# Altium schematic sheet 202014A2232.SchDoc
size A4
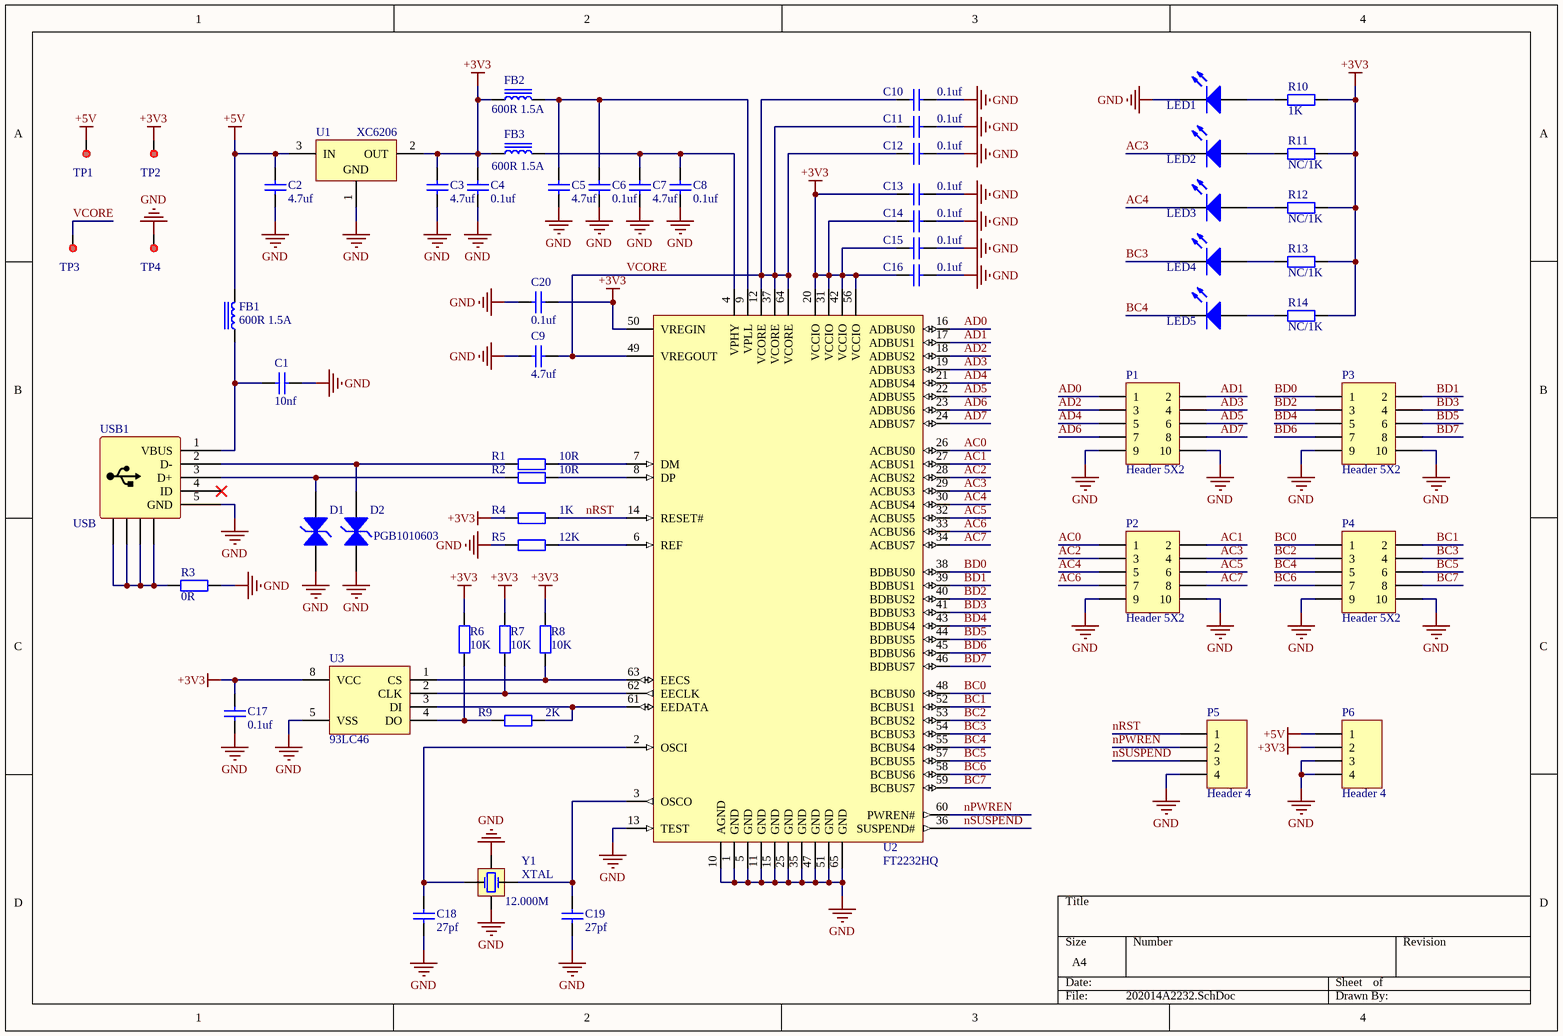
[diagram p0: 202014A2232.SchDoc]

## Parts
C1  value 10nf  [C0805]  (hidden comment: Cap)
C2  value 4.7uf  [C0805]  (hidden comment: Cap)
C3  value 4.7uf  [C0805]  (hidden comment: Cap)
C4  value 0.1uf  [C0805]  (hidden comment: Cap)
C5  value 4.7uf  [C0805]  (hidden comment: Cap)
C6  value 0.1uf  [C0805]  (hidden comment: Cap)
C7  value 4.7uf  [C0805]  (hidden comment: Cap)
C8  value 0.1uf  [C0805]  (hidden comment: Cap)
C9  value 4.7uf  [C0805]  (hidden comment: Cap)
C10  value 0.1uf  [C0805]  (hidden comment: Cap)
C11  value 0.1uf  [C0805]  (hidden comment: Cap)
C12  value 0.1uf  [C0805]  (hidden comment: Cap)
C13  value 0.1uf  [C0805]  (hidden comment: Cap)
C14  value 0.1uf  [C0805]  (hidden comment: Cap)
C15  value 0.1uf  [C0805]  (hidden comment: Cap)
C16  value 0.1uf  [C0805]  (hidden comment: Cap)
C17  value 0.1uf  [C0805]  (hidden comment: Cap)
C18  value 27pf  [C0805]  (hidden comment: Cap)
C19  value 27pf  [C0805]  (hidden comment: Cap)
C20  value 0.1uf  [C0805]  (hidden comment: Cap)
D1  PGB1010603  [PGB1010603-0603]  (value not drawn)
D2  PGB1010603  [PGB1010603-0603]
FB1  value 600R 1.5A  [FB0805]  (hidden comment: Ferrite Bead)
FB2  value 600R 1.5A  [FB0805]  (hidden comment: Ferrite Bead)
FB3  value 600R 1.5A  [FB0805]  (hidden comment: Ferrite Bead)
LED1  LED  [LED1206]  (value not drawn)
LED2  LED  [LED1206]  (value not drawn)
LED3  LED  [LED1206]  (value not drawn)
LED4  LED  [LED1206]  (value not drawn)
LED5  LED  [LED1206]  (value not drawn)
P1  Header 5X2  [HDR2X5]
P2  Header 5X2  [HDR2X5]
P3  Header 5X2  [HDR2X5]
P4  Header 5X2  [HDR2X5]
P5  Header 4  [HDR1X4]
P6  Header 4  [HDR1X4]
R1  value 10R  [R0805]  (hidden comment: Res)
R2  value 10R  [R0805]  (hidden comment: Res)
R3  value 0R  [R0805]  (hidden comment: Res)
R4  value 1K  [R0805]  (hidden comment: Res)
R5  value 12K  [R0805]  (hidden comment: Res)
R6  value 10K  [R0805]  (hidden comment: Res)
R7  value 10K  [R0805]  (hidden comment: Res)
R8  value 10K  [R0805]  (hidden comment: Res)
R9  value 2K  [R0805]  (hidden comment: Res)
R10  value 1K  [R0805]  (hidden comment: Res)
R11  value NC/1K  [R0805]  (hidden comment: Res)
R12  value NC/1K  [R0805]  (hidden comment: Res)
R13  value NC/1K  [R0805]  (hidden comment: Res)
R14  value NC/1K  [R0805]  (hidden comment: Res)
TP1  TestPoint  [TestPoint-R30]  (value not drawn)
TP2  TestPoint  [TestPoint-R30]  (value not drawn)
TP3  TestPoint  [TestPoint-R30]  (value not drawn)
TP4  TestPoint  [TestPoint-R30]  (value not drawn)
U1  XC6206  [XC6206-SOT23]
U2  FT2232HQ  [FT2232HQ-QFN64]
U3  93LC46  [93LC46-SOIC8]
USB1  USB  [USB-Mini-SMT]
Y1  XTAL  value 12.000M  [XTAL-3225]

## Nets
+3V3: C3.2 C4.2 C13.1 C14.1 C15.1 C16.1 C17.2 C20.1 FB2.1 FB3.1 P6.2 R4.1 R6.2 R7.2 R8.2 R10.1 R11.1 R12.1 R13.1 R14.1 TP2.1 U1.2(OUT) U2.20(VCCIO) U2.31(VCCIO) U2.42(VCCIO) U2.50(VREGIN) U2.56(VCCIO) U3.8(VCC)
+5V: C2.2 FB1.2 P6.1 TP1.1 U1.3(IN)
GND: C1.2 C2.1 C3.1 C4.1 C5.1 C6.1 C7.1 C8.1 C9.1 C10.2 C11.2 C12.2 C13.2 C14.2 C15.2 C16.2 C17.1 C18.1 C19.1 C20.2 D1.1 D2.1 LED1.2(K) P1.9 P1.10 P2.9 P2.10 P3.9 P3.10 P4.9 P4.10 P5.4 P6.3 P6.4 R3.2 R5.1 TP4.1 U1.1(GND) U2.1(GND) U2.5(GND) U2.10(AGND) U2.11(GND) U2.13(TEST) U2.15(GND) U2.25(GND) U2.35(GND) U2.47(GND) U2.51(GND) U2.65(GND) U3.5(VSS) USB1.5(GND) Y1.2(GND) Y1.4(GND)
AC0: P2.1 U2.26(ACBUS0)
AC1: P2.2 U2.27(ACBUS1)
AC2: P2.3 U2.28(ACBUS2)
AC3: LED2.2(K) P2.4 U2.29(ACBUS3)
AC4: LED3.2(K) P2.5 U2.30(ACBUS4)
AC5: P2.6 U2.32(ACBUS5)
AC6: P2.7 U2.33(ACBUS6)
AC7: P2.8 U2.34(ACBUS7)
AD0: P1.1 U2.16(ADBUS0)
AD1: P1.2 U2.17(ADBUS1)
AD2: P1.3 U2.18(ADBUS2)
AD3: P1.4 U2.19(ADBUS3)
AD4: P1.5 U2.21(ADBUS4)
AD5: P1.6 U2.22(ADBUS5)
AD6: P1.7 U2.23(ADBUS6)
AD7: P1.8 U2.24(ADBUS7)
BC0: P4.1 U2.48(BCBUS0)
BC1: P4.2 U2.52(BCBUS1)
BC2: P4.3 U2.53(BCBUS2)
BC3: LED4.2(K) P4.4 U2.54(BCBUS3)
BC4: LED5.2(K) P4.5 U2.55(BCBUS4)
BC5: P4.6 U2.57(BCBUS5)
BC6: P4.7 U2.58(BCBUS6)
BC7: P4.8 U2.59(BCBUS7)
BD0: P3.1 U2.38(BDBUS0)
BD1: P3.2 U2.39(BDBUS1)
BD2: P3.3 U2.40(BDBUS2)
BD3: P3.4 U2.41(BDBUS3)
BD4: P3.5 U2.43(BDBUS4)
BD5: P3.6 U2.44(BDBUS5)
BD6: P3.7 U2.45(BDBUS6)
BD7: P3.8 U2.46(BDBUS7)
nPWREN: P5.2 U2.60(PWREN#)
nRST: P5.1 R4.2 U2.14(RESET#)
nSUSPEND: P5.3 U2.36(SUSPEND#)
VCORE: C9.2 C10.1 C11.1 C12.1 TP3.1 U2.12(VCORE) U2.37(VCORE) U2.49(VREGOUT) U2.64(VCORE)
NetC1_1: C1.1 FB1.1 USB1.1(VBUS)
NetC5_2: C5.2 C6.2 FB2.2 U2.9(VPLL)
NetC7_2: C7.2 C8.2 FB3.2 U2.4(VPHY)
NetC18_2: C18.2 U2.2(OSCI) Y1.1(OSC1)
NetC19_2: C19.2 U2.3(OSCO) Y1.3(OSC2)
NetD1_2: D1.2 R2.1 USB1.3(D+)
NetD2_2: D2.2 R1.1 USB1.2(D-)
NetLED1_1: LED1.1(A) R10.2
NetLED2_1: LED2.1(A) R11.2
NetLED3_1: LED3.1(A) R12.2
NetLED4_1: LED4.1(A) R13.2
NetLED5_1: LED5.1(A) R14.2
NetR1_2: R1.2 U2.7(DM)
NetR2_2: R2.2 U2.8(DP)
NetR3_1: R3.1 USB1.6 USB1.7 USB1.8 USB1.9
NetR5_2: R5.2 U2.6(REF)
NetR6_1: R6.1 R9.1 U3.4(DO)
NetR7_1: R7.1 U2.62(EECLK) U3.2(CLK)
NetR8_1: R8.1 U2.63(EECS) U3.1(CS)
NetR9_2: R9.2 U2.61(EEDATA) U3.3(DI)

Not connected (* = marked no-connect by the designer): USB1 4(ID)*

## Library data of the parts
D1 D2 = PGB1010603: Surface Mount Polymeric Electrostatic Discharge Suppressors
P1-P4 = Header 5X2: Header, 5-Pin, Dual row; LatestRevisionDate: 17-Jul-2002; LatestRevisionNote: Re-released for DXP Platform.; Publisher: Altium Limited
P5 P6 = Header 4: Header, 4-Pin; LatestRevisionDate: 17-Jul-2002; LatestRevisionNote: Re-released for DXP Platform.; Publisher: Altium Limited
R1-R14 = Res: 电阻
TP1-TP4 = TestPoint: 测试点
U1 = XC6206: Low ESR Cap. Compatible Positive Voltage Regulators
U2 = FT2232HQ: Dual High Speed USB to Multipurpose UART/FIFO IC
U3 = 93LC46: 1K Microwire Compatible Serial EEPROM
USB1 = USB-SHIELD
Y1 = XTAL3: 无源晶振